# EAGLE design Door (EAGLE 9.1.2)
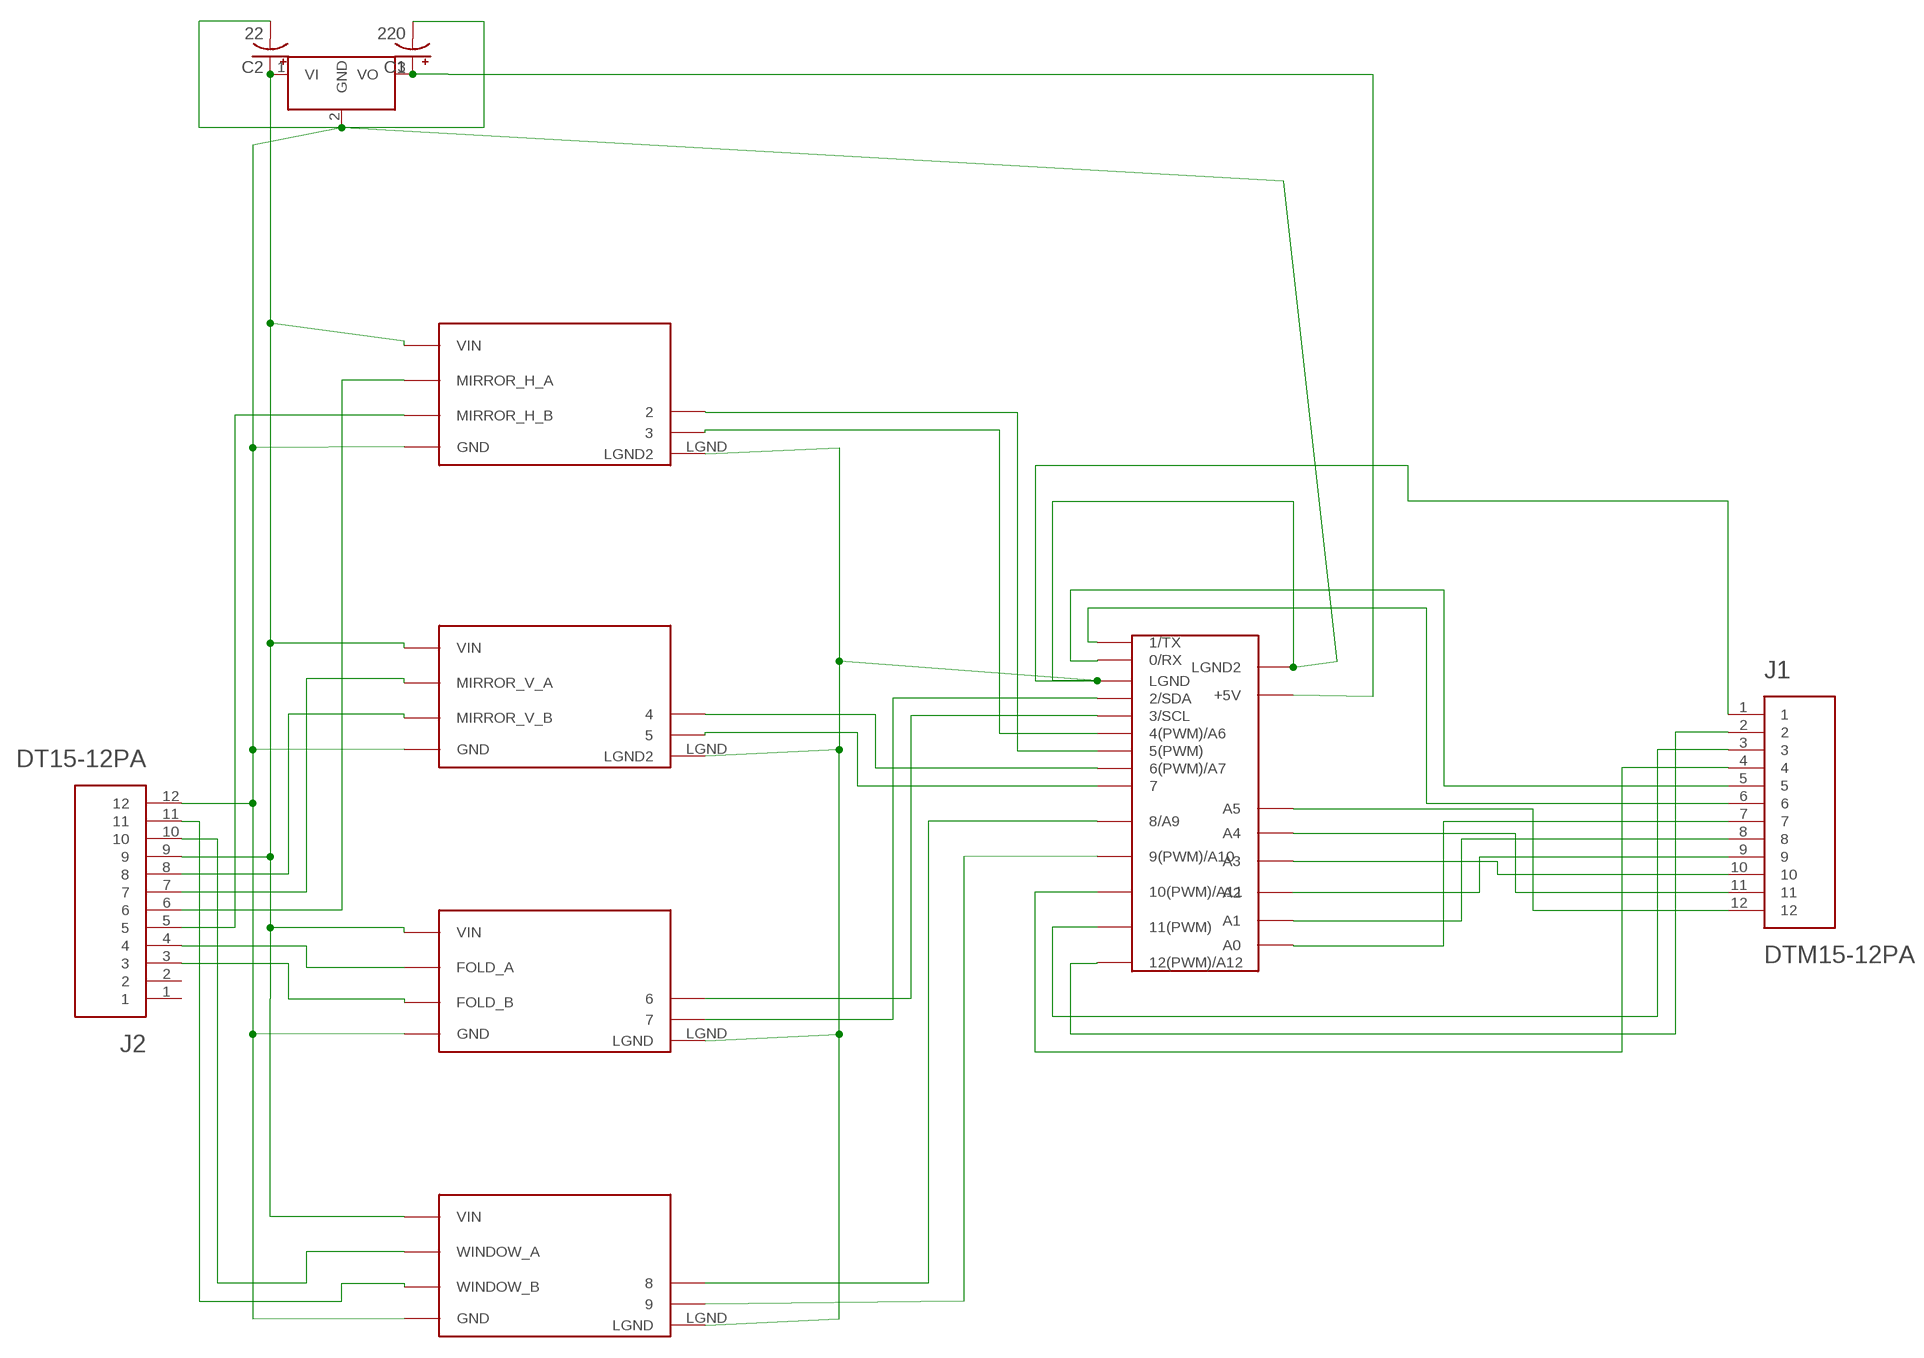
[diagram p0: schematic, sheet 1]

## Parts
C1  220  CAP_POL8MM  [8MMCAP]
C2  22  CAP_POL8MM  [8MMCAP]
FOLD  FOLD_MOTOR  [POLOLU]
HMIRROR  MIRROR_H_MOTOR  [POLOLU]
J1  DTM15-12PA  [TE_DTM15-12PA]
J2  DT15-12PA  [TE_DT15-12PA]
U$5  ARDUINO_MICRO_NEW  [ARDUINO_MICRO_NEW]
U$6  DCDC_OKI-78SR  [OKI-78SRH]
VMIRROR  MIRROR_V_MOTOR  [POLOLU]
WNDOW  WINDOW_MOTOR  [POLOLU]

## Nets
5V: C1.+ U$5.+5V U$6.3(VO)
GND: C1.- C2.- FOLD.GND FOLD.LGND HMIRROR.GND HMIRROR.LGND(LGND2) J1.1 J2.12 U$5.LGND U$5.LGND2 U$6.2(GND) VMIRROR.GND VMIRROR.LGND(LGND2) WNDOW.GND WNDOW.LGND
N$1: FOLD.DIR U$5.2/SDA
N$2: FOLD.PWM U$5.3/SCL
N$3: HMIRROR.PWM U$5.5(PWM)
N$6: HMIRROR.DIR U$5.4(PWM)/A6
N$7: J1.12 U$5.A5
N$8: J1.11 U$5.A4
N$9: U$5.8/A9 WNDOW.PWM
N$10: U$5.9(PWM)/A10 WNDOW.DIR
N$11: J1.10 U$5.A3
N$12: J1.6 U$5.1/TX
N$13: FOLD.OUTA(FOLD_A) J2.4
N$14: J2.8 VMIRROR.OUTB(MIRROR_V_B)
N$15: J2.7 VMIRROR.OUTA(MIRROR_V_A)
N$16: J2.11 WNDOW.OUTB(WINDOW_B)
N$17 [POWER_25]: J2.10 WNDOW.OUTA(WINDOW_A)
N$18: FOLD.OUTB(FOLD_B) J2.3
N$19: HMIRROR.OUTB(MIRROR_H_B) J2.5
N$20: HMIRROR.OUTA(MIRROR_H_A) J2.6
N$21: J1.9 U$5.A2
N$22: J1.8 U$5.A1
N$23: J1.7 U$5.A0
N$24: U$5.6(PWM)/A7 VMIRROR.PWM
N$25: U$5.7 VMIRROR.DIR
N$26: J1.5 U$5.0/RX
N$27: J1.2 U$5.12(PWM)/A12
N$28: J1.3 U$5.11(PWM)
N$29: J1.4 U$5.10(PWM)/A11
VIN: C2.+ FOLD.VIN HMIRROR.VIN J2.9 U$6.1(VI) VMIRROR.VIN WNDOW.VIN
Unconnected: J2.1 J2.2

## Library data of the parts
C1 C2 = carrilib:CAP_POL: Capacitor Polarized These are standard SMD and PTH capacitors. Normally 10uF, 47uF, and 100uF in electrolytic and tantalum varieties. Always verify the external diameter of the through hole cap, it varies with capacity, voltage, and manufacturer. The EIA devices should be standard.
FOLD = Marvelous:FOLD_MOTOR
HMIRROR = Marvelous:MIRROR_H_MOTOR
J1 = DTM15-12PA:DTM15-12PA: DEUTSCH Automotive; DTM RECP ASM; AVAILABILITY: In stock; DESCRIPTION: DEUTSCH Automotive; DTM RECP ASM; MF: TE Connectivity; MPN: DTM15-12PA; PARTREV: B; STANDARD: Manufacturer recommendation
J2 = DT15-12PA:DT15-12PA: DEUTSCH Automotive; DT RECP ASM; AVAILABILITY: In stock; DESCRIPTION: DEUTSCH Automotive; DT RECP ASM; MF: TE Connectivity; MPN: DT15-12PA; PARTREV: C3; STANDARD: Manufacturer recommendation
U$5 = Marvelous:ARDUINO_MICRO_NEW
U$6 = carrilib:DCDC_OKI-78SR: 4.95W DC/DC Converter Manufacturer: Murata Part Number: OKI-78SR-5/1.5-W36H-C OKI-78SR-3.3/1.5-W36H-C
VMIRROR = Marvelous:MIRROR_V_MOTOR
WNDOW = Marvelous:WINDOW_MOTOR

## Net classes
1 POWER_25: width 2.54 mm
2 GROUND_25: width 2.54 mm
3 POWER_5: width 0.508 mm
4 GROUND_5: width 0.508 mm

## Board
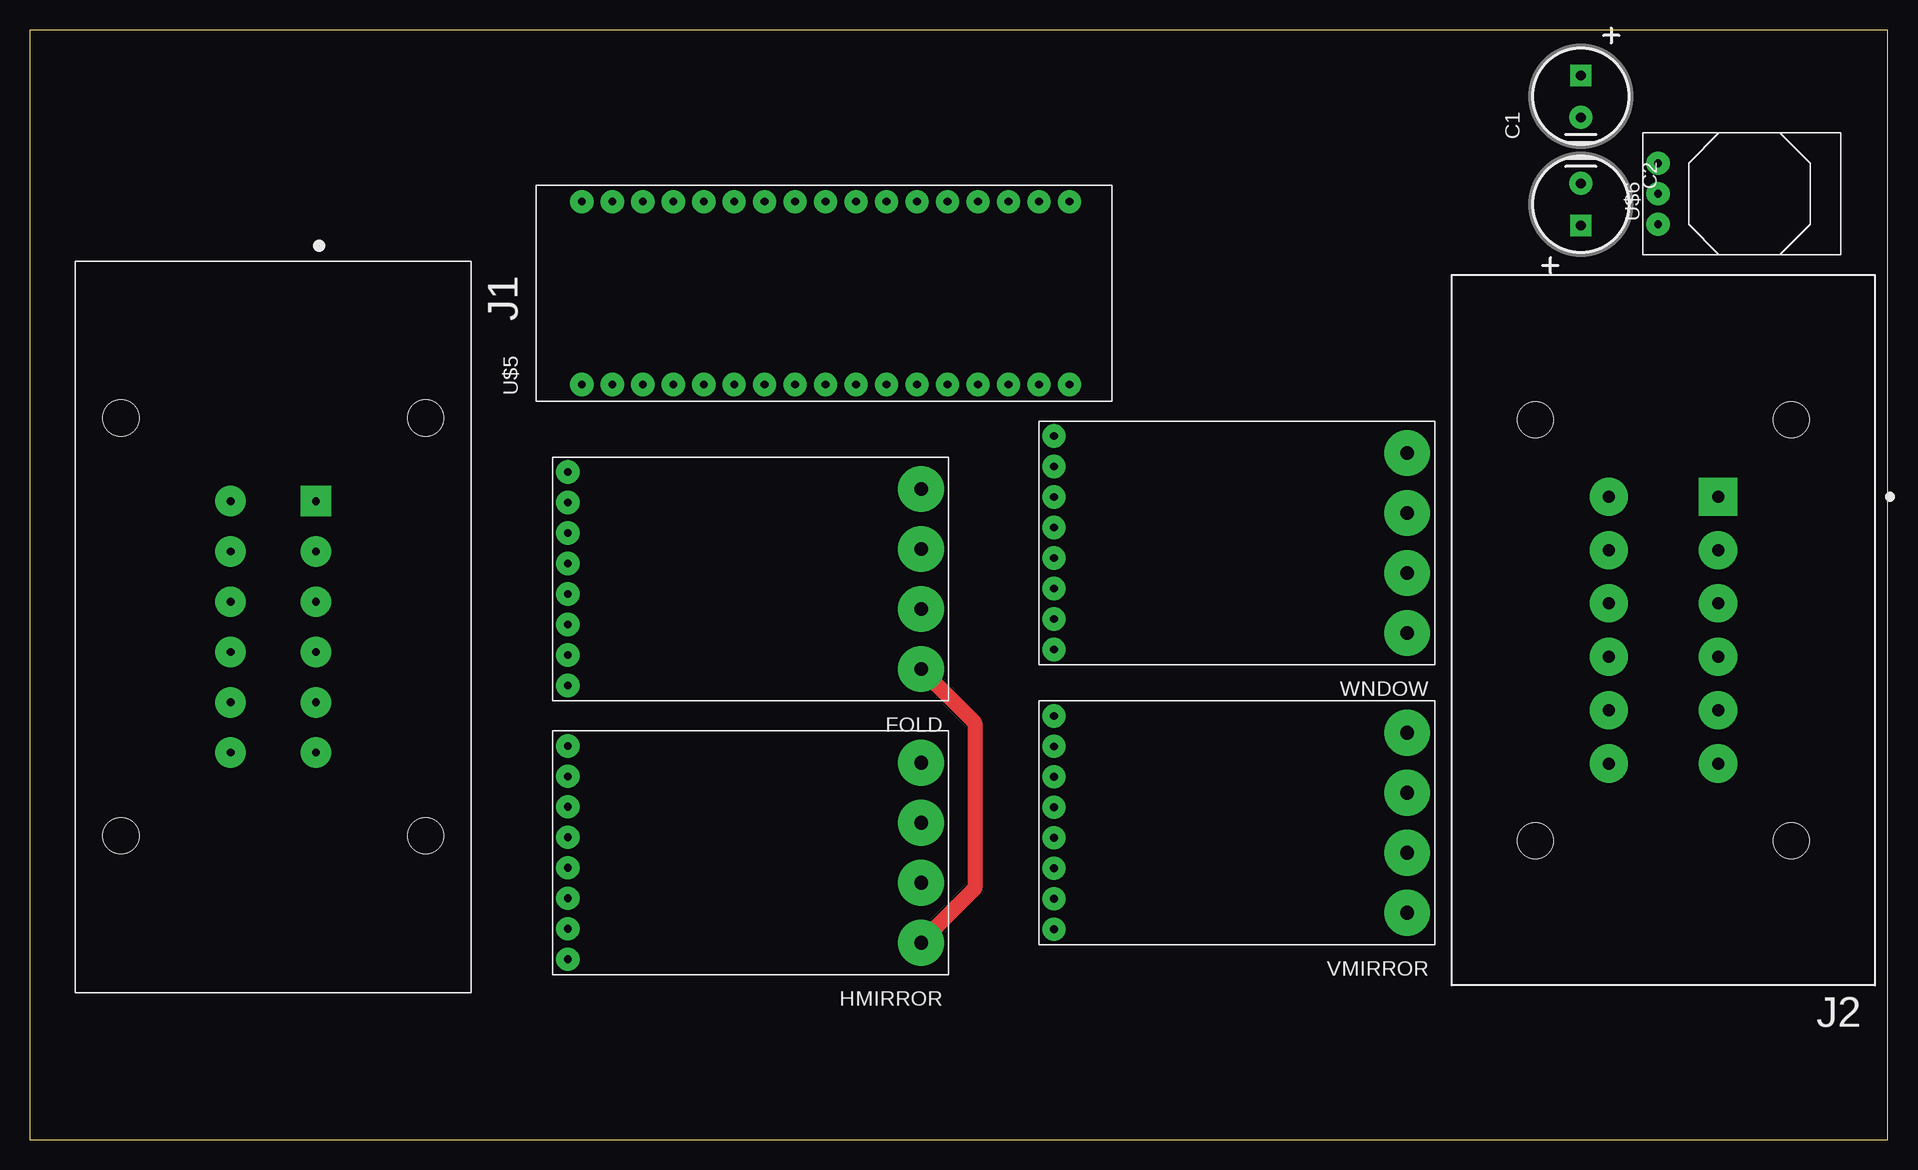
[diagram p1: board, top side]
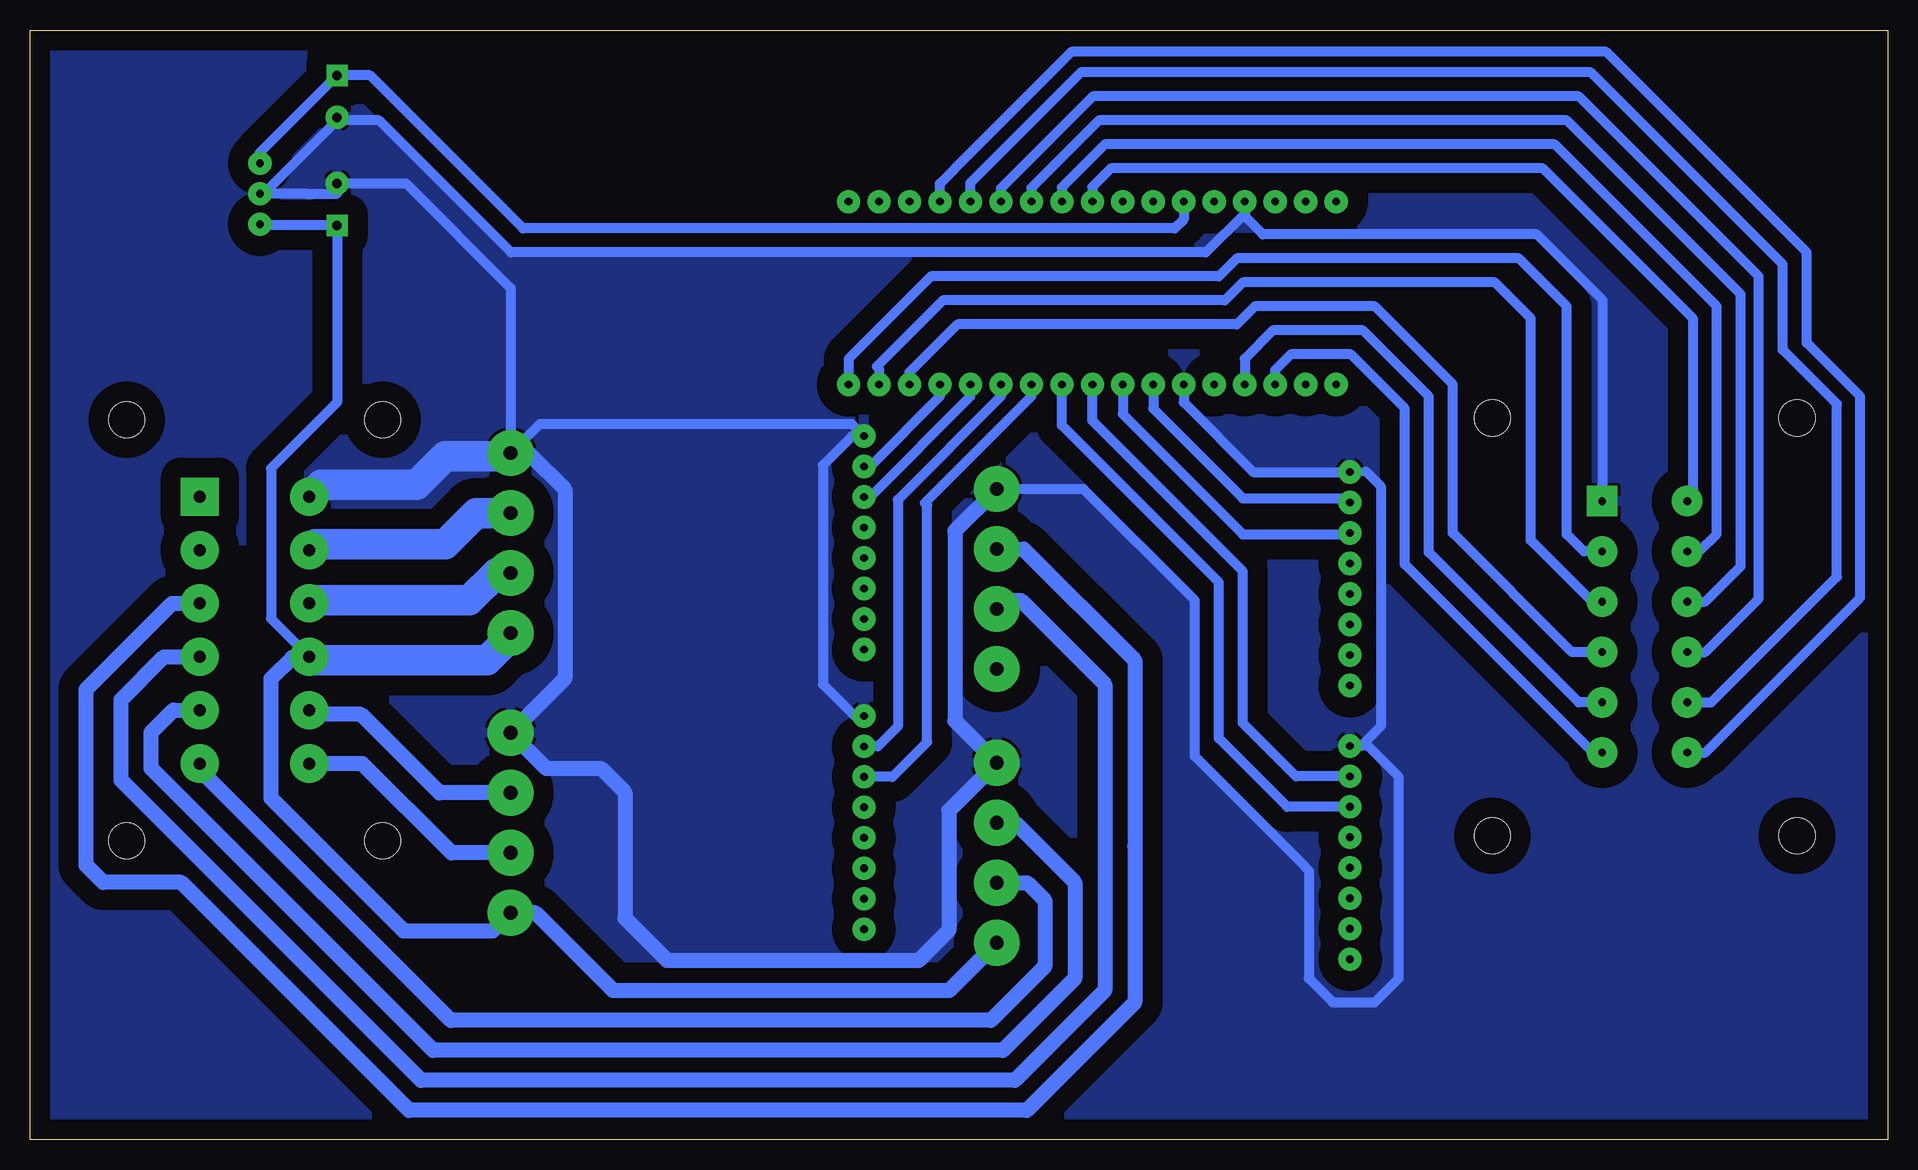
[diagram p2: board, bottom side, seen from below]

Size 154.87 x 92.49 mm. Coordinates in mm from the lower left corner, seen from the top.
Outline: 0,0 154.87,0 154.87,92.49 0,92.49 0,0
Copper layers (1*16): Top 0.035mm / dielectric 1.5mm / Bottom 0.035mm
Design rules "default": minimum track width 6mil, minimum drill 0.35mm, track to track 6mil, track to pad 6mil, pad to pad 6mil, via to via 6mil, smd to smd 6mil, copper to edge 40mil, drill to drill 6mil, minimum pad ring 10mil, minimum via ring 8mil, stop-mask expansion 4mil, vias tented up to drill 0mil, thermal gap 10mil

### Footprints (pad centres in the part's own frame; a part is rotated, then mirrored left to right if it is on the bottom)
8MMCAP = drill 0.8 pad 1.778 square: + -1.75,0 | drill 0.8 pad 1.93: - 1.75,0
POLOLU = drill 0.65 pad 1.93: 3V3 15.23,6.34; CS 15.23,3.8; DIR 15.23,-6.36; FLT 15.23,1.26; LGND 15.23,-8.9; PWM 15.23,-3.82; SLP 15.23,-1.28; VM 15.23,8.88 | drill 1.143 pad 3.81: GND -14.21,-7.49; OUTA -14.21,2.51; OUTB -14.21,-2.49; VIN -14.21,7.51
TE_DTM15-12PA = drill 0.65 pad 2.54 square: 1 -10.475,3.555 | drill 0.65 pad 2.54: 2 -6.285,3.555; 3 -2.095,3.555; 4 2.095,3.555; 5 6.285,3.555; 6 10.475,3.555; 7 10.475,-3.555; 8 6.285,-3.555; 9 2.095,-3.555; 10 -2.095,-3.555; 11 -6.285,-3.555; 12 -10.475,-3.555 | hole 2.99: -17.41,-12.7; -17.41,12.7; 17.41,12.7; 17.41,-12.7
TE_DT15-12PA = drill 1 pad 3.175 square: 1 -4.56,-11.115 | drill 1 pad 3.175: 2 -4.56,-6.67; 3 -4.56,-2.225; 4 -4.56,2.225; 5 -4.56,6.67; 6 -4.56,11.115; 7 4.56,11.115; 8 4.56,6.67; 9 4.56,2.225; 10 4.56,-2.225; 11 4.56,-6.67; 12 4.56,-11.115 | hole 2.99: -10.67,17.535; 10.67,17.535; 10.67,-17.545; -10.67,-17.545
ARDUINO_MICRO_NEW = drill 0.65 pad 1.93: 0/RX -7.62,12.57; 1/TX -7.62,15.11; 2/SDA -7.62,4.95; 3.3V 7.62,-17.91; 3/SCL -7.62,2.41; 4(PWM)/A6 -7.62,-0.13; 5(PWM) -7.62,-2.67; 6(PWM)/A7 -7.62,-5.21; 7 -7.62,-7.75; 8/A9 -7.62,-10.29; 9(PWM)/A10 -7.62,-12.83; 10(PWM)/A11 -7.62,-15.37; 11(PWM) -7.62,-17.91; 12(PWM)/A12 -7.62,-20.45; 13(PWM) 7.62,-20.45; +5V 7.62,7.49; A0 7.62,-12.83; A1 7.62,-10.29; A2 7.62,-7.75; A3 7.62,-5.21; A4 7.62,-2.67; A5 7.62,-0.13; AREF 7.62,-15.37; LGND -7.62,7.49; LGND2 7.62,12.57; MISO 7.62,17.65; MOSI -7.62,20.19; N/C 7.62,4.95; NC 7.62,2.41; RESET -7.62,10.03; RESET2 7.62,10.03; RX_LED/SS -7.62,17.65; SCK 7.62,20.19; VIN1 7.62,15.11
OKI-78SRH = drill 0.65 pad 1.93: 1 2.54,0; 2 0,0; 3 -2.54,0

### Placement (x,y rotation side)
C1  129.27,86.96 270 top
C2  129.27,77.96 90 top
FOLD  60.07,46.75 180 top
HMIRROR  60.07,23.93 180 top
J1  20.28,42.75 270 top
J2  136.15,42.48 180 top
U$5  66.19,70.57 90 top
U$6  135.71,78.85 270 top
VMIRROR  100.59,26.43 180 top
WNDOW  100.59,49.75 180 top

### Tracks (layer width: path | path; a pad name or v marks a point on that pad's centre or on a via)
5V
  Bottom 0.813: U$5.+5V 58.7,76.73 59.47,75.96 113.77,75.96 126.52,88.71 C1.+ 135.71,82.27 U$6.3
GND
  Bottom 0.61: 129.27,78.85 C2.- | U$5.LGND2 53.62,77.96 53.62,77.19 | 86.14,35.33 VMIRROR.LGND | WNDOW.LGND 86.36,58.65 | J1.1 23.77,53.29 | FOLD.LGND 43.58,55.65 43.52,55.71 | 43.9,32.83 HMIRROR.LGND | 48.27,22.46 48.52,22.71 48.27,22.46
  Bottom 0.813: C1.- 129.27,84.96 | 135.38,78.85 U$6.2 | 129.27,84.96 135.38,78.85 | 129.27,78.85 131.88,78.85 134.38,78.85 135.38,78.85 | 53.62,77.19 56.85,73.96 114.77,73.96 125.77,84.96 129.27,84.96 | C2.- 123.52,79.71 114.8,70.99 WNDOW.GND 112.39,59.65 86.36,59.65 WNDOW.LGND | FOLD.LGND 52.9,55.65 58.7,61.45 U$5.LGND | 86.36,58.65 88.77,56.24 88.77,37.96 86.14,35.33 | 48.52,22.71 57.77,31.96 57.77,44.96 67.05,54.24 FOLD.GND | 23.77,53.29 23.77,69.96 29.27,75.46 52.12,75.46 53.62,76.96 53.62,77.96 | 43.52,55.71 42.27,54.46 42.27,34.46 43.9,32.83 | 48.27,22.46 48.27,13.46 46.27,11.46 42.77,11.46 40.77,13.46 40.77,30.26 43.34,32.83 HMIRROR.LGND
  Bottom 1.27: FOLD.GND 77.77,50.75 77.77,34.91 HMIRROR.GND 78.27,27.43 78.27,17.46 80.77,14.96 101.77,14.96 105.27,18.46 105.27,28.96 107.27,30.96 111.84,30.96 VMIRROR.GND 110.27,38.45 110.27,54.21 113.3,57.24 WNDOW.GND
  Bottom 2.54: WNDOW.GND 115.08,56.96 120.27,56.96 122.63,54.59 130.59,54.59 J2.12
  pour Bottom (isolate 1.676): 0.27,92.46 154.77,92.46 154.77,0.46 0.27,0.46
N$1
  Bottom 0.61: 45.19,53.46 FOLD.DIR
  Bottom 0.813: 45.19,53.46 53.77,53.46 61.24,60.93 U$5.2/SDA
N$2
  Bottom 0.61: 44.95,50.46 FOLD.PWM
  Bottom 0.813: 44.95,50.46 53.77,50.46 63.78,60.47 U$5.3/SCL
N$3
  Bottom 0.813: U$5.5(PWM) 68.86,59.55 55.77,46.46 55.77,33.46 50.06,27.75 HMIRROR.PWM
N$6
  Bottom 0.813: U$5.4(PWM)/A6 66.32,59.93 53.77,47.38 53.77,34.72 49.34,30.29 HMIRROR.DIR
N$7
  Bottom 0.813: U$5.A5 66.32,79.41 64.77,80.96 28.77,80.96 16.23,68.41 16.23,53.73 J1.12
N$8
  Bottom 0.813: U$5.A4 68.86,79.37 65.27,82.96 27.77,82.96 14.27,69.46 14.27,50.49 15.72,49.04 J1.11
N$9
  Bottom 0.813: U$5.8/A9 76.48,61.95 84.86,53.57 WNDOW.PWM
N$10
  Bottom 0.813: U$5.9(PWM)/A10 79.02,61.95 84.86,56.11 WNDOW.DIR
N$11
  Bottom 0.813: U$5.A3 71.4,79.33 65.77,84.96 26.77,84.96 12.27,70.46 12.27,47.8 15.22,44.84 J1.10
N$12
  Bottom 0.61: J1.6 24.15,31.96
  Bottom 0.813: 24.15,31.96 24.27,31.96 40.27,47.96 40.27,60.96 44.77,65.46 49.77,65.46 51.08,64.15 U$5.1/TX
N$13
  Bottom 1.27: FOLD.OUTA 73.56,44.96 72.27,44.96 65.27,37.96 65.27,12.46 72.77,4.96 122.27,4.96 147.27,29.96 147.27,36.7 143.71,40.26 J2.4
N$14
  Bottom 1.27: J2.8 131.24,35.46 127.27,35.46 120.73,28.92 VMIRROR.OUTB
N$15
  Bottom 1.27: J2.7 127.17,31.37 119.73,23.92 VMIRROR.OUTA
N$16
  Bottom 2.54: WNDOW.OUTB 117.68,52.24 120.27,49.65 131.09,49.65 J2.11
N$17
  Bottom 2.54: WNDOW.OUTA 115.99,47.24 118.27,44.96 131.34,44.96 J2.10
N$18
  Bottom 1.27: FOLD.OUTB 72.05,49.24 62.77,39.96 62.77,24.46 62.77,11.46 71.77,2.46 123.27,2.46 142.27,21.46 148.77,21.46 150.19,22.88 150.19,37.54 143.03,44.7 J2.3
N$19
  Bottom 1.27: HMIRROR.OUTB 72.73,26.42 67.77,21.46 67.77,13.46 73.77,7.46 121.27,7.46 144.77,30.96 144.77,33.96 142.92,35.81 J2.5
N$20
  Bottom 1.27: HMIRROR.OUTA 71.73,21.42 70.27,19.96 70.27,14.46 74.77,9.96 119.8,9.96 140.71,30.87 J2.6
N$21
  Bottom 0.813: U$5.A2 73.94,79.29 66.27,86.96 25.77,86.96 10.77,71.96 10.77,45.11 15.22,40.66 J1.9
N$22
  Bottom 0.813: U$5.A1 76.48,79.75 67.27,88.96 24.77,88.96 8.77,72.96 8.77,65.83 4.26,61.33 4.26,46.93 14.72,36.47 J1.8
N$23
  Bottom 0.61: 77.77,80.96 77.77,80.94
  Bottom 0.813: 77.77,80.94 79.02,79.69 U$5.A0 | 77.77,80.96 68.06,90.67 23.48,90.67 6.77,73.96 6.77,66.41 2.32,61.96 2.32,45.18 15.22,32.28 J1.7
N$24
  Bottom 0.813: U$5.6(PWM)/A7 71.4,61.95 80.27,53.08 80.08,52.89 80.08,33.15 82.98,30.25 VMIRROR.PWM
N$25
  Bottom 0.813: U$5.7 73.94,61.95 82.53,53.36 82.53,34.46 84.2,32.79 VMIRROR.DIR
N$26
  Bottom 0.813: J1.5 25.77,36.47 38.27,48.96 38.27,61.96 43.77,67.46 51.27,67.46 53.62,65.11 U$5.0/RX
N$27
  Bottom 0.813: J1.2 25.34,49.04 26.77,50.46 26.77,69.46 30.77,73.46 54.27,73.46 55.77,71.96 79.77,71.96 86.64,65.09 U$5.12(PWM)/A12
N$28
  Bottom 0.61: 84.27,64.46 84.1,64.29
  Bottom 0.813: J1.3 24.66,44.84 29.77,49.96 29.77,68.46 32.77,71.46 53.77,71.46 55.27,69.96 78.77,69.96 84.27,64.46 | 84.1,64.29 U$5.11(PWM)
N$29
  Bottom 0.813: J1.4 26.34,40.66 36.27,50.59 36.27,62.96 42.77,69.46 52.77,69.46 54.27,67.96 77.55,67.96 81.56,63.95 U$5.10(PWM)/A11
VIN
  Top 1.27: FOLD.VIN 78.77,34.75 78.77,20.96 74.28,16.47 HMIRROR.VIN
  Bottom 0.61: 131.53,40.2 131.3,39.96
  Bottom 0.813: U$6.1 135.61,76.21 C2.+ 129.27,61.46 134.77,55.96 134.77,43.44 131.53,40.2
  Bottom 1.27: HMIRROR.VIN 78.24,12.46 106.27,12.46 112.73,18.92 VMIRROR.VIN 116.3,17.42 123.73,17.42 134.77,28.46 134.77,38.46 133.03,40.2 131.53,40.2
  Bottom 2.54: WNDOW.VIN 114.8,41.93 116.77,39.96 131.3,39.96 131.53,40.2 J2.9